# Altium schematic sheet SCHEMA.SchDoc
size 381 x 241 mm; SheetNumber: 1; SheetTotal: 1
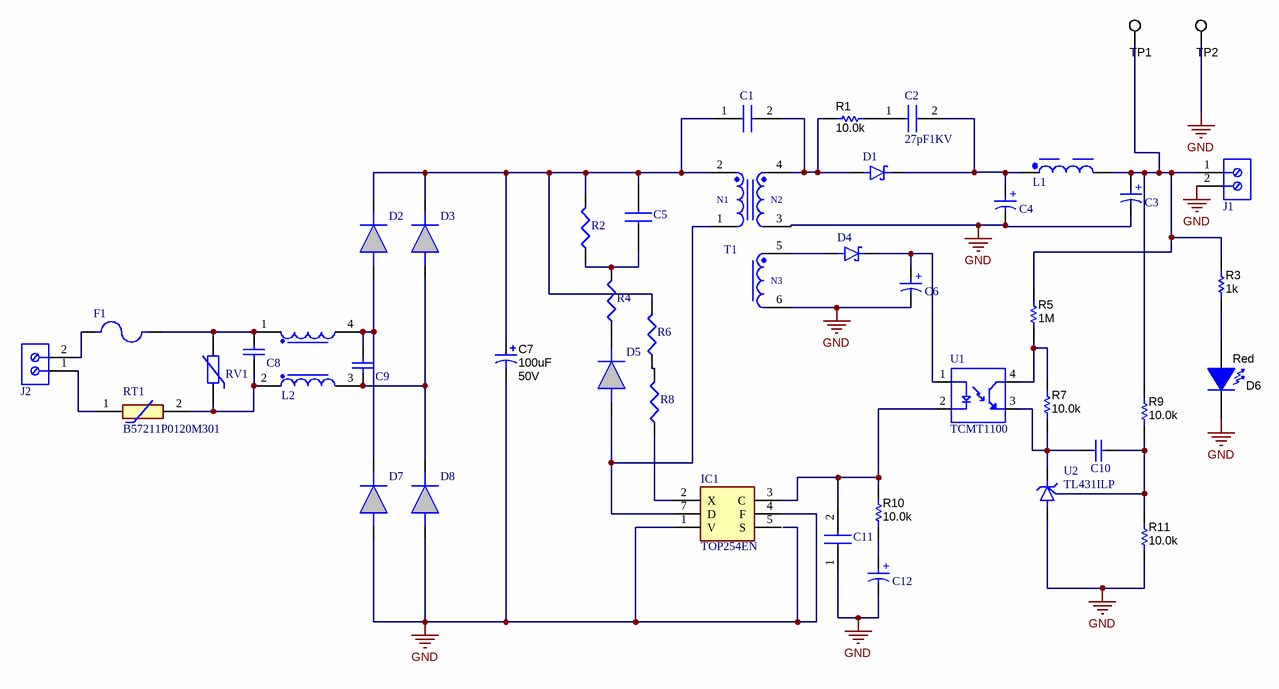
[diagram p0: SCHEMA.SchDoc]

## Parts
C1  c270.22nf-250VAC  [440LT22R]  (value not drawn)
C2  27pF1KV  [S270K25SL0N63L6R]
C3  180µF  [WCAP-PTG5_D8H8]  (value not drawn)
C4  22uF  [WCAP-ATG8_D5H11]  (value not drawn)
C5  FG26C0G2J391JNT06  [capacitor_ceramic]  (value not drawn)
C6  22uF  [WCAP-ATG8_D5H11]  (value not drawn)
C7  ValueDisplayed: 100uF  VDC_V: 50V  [BT_1000x1250]  (hidden comment: UBT1H101MPD1TD)
C8  15nF  [WCAP-FTX2_L11W6H10]  (value not drawn)
C9  15nF  [WCAP-FTX2_L11W6H10]  (value not drawn)
C10  15nF  [WCAP-FTX2_L11W6H10]  (value not drawn)
C11  0.1 μF, 50 V, Ceramic, X7R  [C322]  (value not drawn)
C12  180µF  [WCAP-PTG5_D8H8]  (value not drawn)
D1  diode shotcky  [DIOM7959X265N]  (value not drawn)
D2  1N4006-E3_54  [DIOAD1405W86L465D235]  (value not drawn)
D3  1N4006-E3_54  [DIOAD1405W86L465D235]  (value not drawn)
D4  diode shotcky  [DIOM7959X265N]  (value not drawn)
D5  RMPG06K-E3_54  [DIOAD1271W66L305D242]  (value not drawn)
D6  value Red  [LED_LTST-C190_Red]  (hidden comment: LTST-C190CKT)
D7  1N4006-E3_54  [DIOAD1405W86L465D235]  (value not drawn)
D8  1N4006-E3_54  [DIOAD1405W86L465D235]  (value not drawn)
F1  fuse tht  [FUSE_0154004.DR]  (value not drawn)
IC1  TOP254EN  [TOP265EG]
J1  691101710002  [691103110002]  (value not drawn)
J2  691101710002  [Model Name]  (value not drawn)
L1  3900µH, 0.18A  [INDUCTOR_TH]  (value not drawn)
L2  39mH  [WE-CMB_Type L_L27.5W18.5H33]  (value not drawn)
R1  ValueDisplayed: 10.0k  [RES_0603]  (hidden comment: ERA-3ARW103V)
R2  0.15Ω  [RESAD1590W60L630D240]  (value not drawn)
R3  value 1k  [0402L]  (hidden comment: CRCW0402510RJNED)
R4  0.15Ω  [RESAD1590W60L630D240]  (value not drawn)
R5  ValueDisplayed: 1M  [0603L]  (hidden comment: ERA-3ARW103V)
R6  0.15Ω  [RESAD1590W60L630D240]  (value not drawn)
R7  ValueDisplayed: 10.0k  [RES_0603]  (hidden comment: ERA-3ARW103V)
R8  0.15Ω  [RESAD1590W60L630D240]  (value not drawn)
R9  ValueDisplayed: 10.0k  [RES_0603]  (hidden comment: ERA-3ARW103V)
R10  ValueDisplayed: 10.0k  [RES_0603]  (hidden comment: ERA-3ARW103V)
R11  ValueDisplayed: 10.0k  [RES_0603]  (hidden comment: ERA-3ARW103V)
RT1  B57211P0120M301  [B57211P0***M3*1]
RV1  130VAC, 170VDC  [VARISTOR]  (value not drawn)
T1  85-265Vin, 5Vout  [TRANSFORMER_E22]  (value not drawn)
TP1  5016  [Testpoint_Keystone_Compact]  (value not drawn)
TP2  5016  [Testpoint_Keystone_Compact]  (value not drawn)
U1  TCMT1100  [SOIC127P700X230-4N]
U2  TL431ILP  [TL431CLP]

## Nets
GND: C3.2(N) C4.2(N) C6.2(N) C7.2(-) C11.1 C12.2(N) D6.2(K) D7.2(A) D8.2(A) IC1.1(V) IC1.4(F) J1.2 R11.1 T1.3 T1.6 TP2.1 U2.2(A)
NetC1_1: C1.1 C5.1 C7.1(+) D2.1(K) D3.1(K) R2.2 R6.2 T1.2
NetC1_2: C1.2 D1.A R1.2 T1.4
NetC2_1: C2.1 R1.1
NetC2_2: C2.2 C4.1(P) D1.C(K) L1.1
NetC3_1: C3.1(P) J1.1 L1.2 R3.2 R5.1 R9.2 TP1.1
NetC5_2: C5.2 R2.1 R4.2
NetC6_1: C6.1(P) D4.C(K) U1.1(A)
NetC8_1: C8.1 L2.2 RT1.2 RV1.1
NetC8_2: C8.2 F1.2 L2.1 RV1.2
NetC9_1: C9.1 D3.2(A) D8.1(K) L2.3
NetC9_2: C9.2 D2.2(A) D7.1(K) L2.4
NetC10_1: C10.1 R7.2 U1.3(ET) U2.3(C)
NetC10_2: C10.2 R9.1 R11.2 U2.1(REF)
NetC11_2: C11.2 IC1.3(C) R10.1 U1.2(C)
NetC12_1: C12.1(P) R10.2
NetD4_A: D4.A T1.5
NetD5_1: D5.1(K) R4.1
NetD5_2: D5.2(A) IC1.7(D) T1.1
NetD6_1: D6.1(A) R3.1
NetF1_1: F1.1 J2.2
NetIC1_2: IC1.2(X) R8.1
NetJ2_1: J2.1 RT1.1
NetR5_2: R5.2 R7.1 U1.4(CT)
NetR6_1: R6.1 R8.2

Not connected (* = marked no-connect by the designer): IC1 5(S)

## Notes on the sheet
- (in symbol 100uf 16v) +
- (in symbol 1800uf 25v) +
- (in symbol 749118105) N1; N2; N3

## Library data of the parts
C1 = c270.22nf-250VAC: Capacitor; Manufacturer_Name: Vishay; Manufacturer_Part_Number: 440LT22-R; Datasheet Link: https://componentsearchengine.com/Datasheets/2/440LT22-R.pdf; Height: 11.6mm; Mouser Part Number: 75-440LT22-R; Mouser Price/Stock: https://www.mouser.co.uk/ProductDetail/Vishay/440LT22-R?qs=SlHcmTmoTud7%252BtFxR7La5w%3D%3D; Arrow Part Number: 440LT22-R; Arrow Price/Stock: https://www.arrow.com/en/products/440lt22-r/vishay
C2 = 27pF1KV: Capacitor; Manufacturer_Name: Vishay; Datasheet Link: https://www.vishay.com/docs/28515/sseries.pdf; Height: 9.5mm; Manufacturer_Part_Number: S270K25SL0N63L6R; Mouser Part Number: 594-S270K25SL0N63L6R; Mouser Price/Stock: https://www.mouser.co.uk/ProductDetail/Vishay-BC-Components/S270K25SL0N63L6R?qs=a%252BZougrH3ejvblLoEtzSMA%3D%3D; Arrow Part Number: S270K25SL0N63L6R; Arrow Price/Stock: https://www.arrow.com/en/products/s270k25sl0n63l6r/vishay
C3 C12 = 100uf 16v: WCAP-PTG5 Aluminum Polymer Capacitor, Radial THT, D8 x H8mm, 180µF, 6.3V; Manufacturer Part Number: 870025174001; Manufacturer: Wurth Elektronik; Capacitance Tolerance: +/-20%; Dissipation Factor: 7%; Endurance: 2000h; ESR: 21mΩ; Leakage Current: 226.8µA; Ripple Current: 5100mA; Technical Reference: PTEE080181M6R3DSPA7B000; Category: Aluminum Polymer Capacitors; Match Code: WCAP-PTG5; ComponentLink1Description: Website Link; ComponentLink1URL: https://www.we-online.com/redexpert/article/870025174001?ad; ComponentLink2Description: Datasheet Link; ComponentLink2URL: https://www.we-online.com/redexpert/spec/870025174001?ad; Mount: Through Hole; Operating Temperature Max: 105°C; Operating Temperature Min: -55°C; Packaging: Ammo Pack; Height: 8mm; Diameter: 8mm; Capacitance: 180µF; Rated Voltage (DC): 6.3V
C4 C6 = 1800uf 25v: WCAP-ATG8 Aluminum Electrolytic Capacitor, Radial, THT, D5 x H11mm, 22uF, 10V; Manufacturer Part Number: 860010272001; Manufacturer: Wurth Elektronik; Capacitance Tolerance: +/-20%; Dissipation Factor: 19%; Endurance: 2000h; Leakage Current: 3uA; Ripple Current: 66mA; Technical Reference: ATBC110220M010DSPA3B000; Category: Aluminum Electrolytic Capacitors; Match Code: WCAP-ATG8; ComponentLink1Description: Website Link; ComponentLink1URL: https://www.we-online.com/redexpert/article/860010272001?ad; ComponentLink2Description: Datasheet Link; ComponentLink2URL: https://www.we-online.com/redexpert/spec/860010272001?ad; Mount: Through Hole; Operating Temperature Max: 85°C; Operating Temperature Min: -40°C; Packaging: Ammo Pack; Height: 11mm; Diameter: 5mm; Capacitance: 22uF; Rated Voltage (DC): 10V
C5 = 1.5 nF, 630 V, High Voltage Ceramic: MLCC with Dipped Radial Lead, Capacitance=390pF, LxWxT:5.5x6x3.5mm, Lead pitch:5mm; Manufacturer_Name: TDK; Geometry.Height: 6mm; Mouser Part Number: 810-FG26C0G2J391JNT6; Mouser Price/Stock: https://www.mouser.co.uk/ProductDetail/TDK/FG26C0G2J391JNT06?qs=icAhCOE9TbgfNHYPSEYhhw%3D%3D; Manufacturer_Part_Number: FG26C0G2J391JNT06; Datasheet Link: https://product.tdk.com/system/files/dam/doc/product/capacitor/ceramic/lead-mlcc/catalog/leadmlcc_halogenfree_fg_en.pdf
C7 = CMP-0009918-2: CAP, AL, 100 uF, 50 V, +/- 20%, TH; Manufacturer: Nichicon; Polarized: Y; CompType: Capacitor; Value: 100uF; U/M: EA; Cap_F: 100µF; Value1: Unknown; IRMS_A: 5.55dA; TaMin_C: -40°C; TaMax_C: 125°C; Cap_Case: 10x12.5mm; SizeAreaWB_mm2: 144; SizeArea_mm2: 100; SizeX_mm: 10; SizeZ_mm: 14.5; AEC Category: Q200; AEC Qualified: N; PartNumber: UBT1H101MPD1TD; PackageReference: Cap, 10x12.5mm; RoHS: Y; Tolerance_%: 20%; Value2: 50V; MountType: TH; Technology: AL; Series: BT; Publisher: Texas Instruments; LatestRevisionDate: 2017-03-09; ComponentLink1Description: Datasheet link; ComponentLink1URL: http://nichicon-us.com/english/products/pdfs/e-ubt.pdf; Supplier 1: Digi-Key; Supplier Part Number 1: 493-4508-1-ND; Supplier 2: Newark; Supplier Part Number 2: 26T5990; Supplier 3: Mouser; Supplier Part Number 3: 647-UBT1H101MPD1TD; SizeY_mm: 10; AEC Grade: N/A
C8-C10 = 100nF275V iNPUT choke: WCAP-FTX2 Film Capacitor, THT, L11 x W6 x H10mm, 15nF, 275V; Manufacturer Part Number: 890324022007; Manufacturer: Wurth Elektronik; Capacitance Tolerance: +/-10%; Dissipation Factor @1kHz: 0.1%; Dissipation Factor @100kHz: 0.5%; Insulation Resistance: 30000MΩ; Pitch: 7.5mm; Rate of Voltage Rise: 500V/µs; Technical Reference: MX2P075153K275ASPB15000; Category: Film Capacitors; Match Code: WCAP-FTX2; ComponentLink1Description: Website Link; ComponentLink1URL: https://www.we-online.com/redexpert/article/890324022007?ad; ComponentLink2Description: Datasheet Link; ComponentLink2URL: https://www.we-online.com/redexpert/spec/890324022007?ad; Mount: Through Hole; Operating Temperature Max: 105°C; Operating Temperature Min: -40°C; Packaging: Carton; Length: 11mm; Width: 6mm; Height: 10mm; Capacitance: 15nF; Dissipation Factor @10kHz: 0.1%; Rated Voltage (AC): 275V
C11 = 0.1 μF, 50 V, Ceramic, X7R: Capacitor; Manufacturer_Name: KEMET; Manufacturer_Part_Number: C322C104K5R5TA; Datasheet Link: https://content.kemet.com/datasheets/KEM_C1050_GOLDMAX_X7R.pdf; Height: 6.6mm; Mouser Part Number: 80-C322C104K5R; Mouser Price/Stock: https://www.mouser.co.uk/ProductDetail/KEMET/C322C104K5R5TA?qs=XvIqZs20p47gvrtGJkxvnw%3D%3D; Arrow Part Number: C322C104K5R5TA; Arrow Price/Stock: https://www.arrow.com/en/products/c322c104k5r5ta/kemet-corporation?region=nac
D1 D4 = diode shotcky: Diode Schottky 40 V 3A Surface Mount SMC (DO-214AB); MF: ON Semiconductor; MP: SS34; Package: SMC-2 ON Semiconductor; Value: *; Availability: In Stock; SnapEDA_Link: https://www.snapeda.com/parts/SS34/Onsemi/view-part/?ref=snap; Price: None; Check_prices: https://www.snapeda.com/parts/SS34/Onsemi/view-part/?ref=eda
D2 D3 D7 D8 = 1N4006-E3_54_1: Vishay 1N4006-E3/54 Diode, 800V 1A, 2-Pin DO-204AL; Mouser Part Number: 625-1N4006-E3/54; Mouser Price/Stock: https://www.mouser.co.uk/ProductDetail/Vishay-General-Semiconductor/1N4006-E3-54?qs=N4vtoAxH%2FSrsleYv417wqA%3D%3D; Manufacturer_Name: Vishay; Manufacturer_Part_Number: 1N4006-E3/54; Datasheet Link: https://componentsearchengine.com/Datasheets/2/1N4006-E3_54.pdf
D5 = RMPG06K-E3_54: Rectifiers 800 Volt 1.0A 250ns 40 Amp IFSM; Manufacturer_Name: Vishay; Manufacturer_Part_Number: RMPG06K-E3/54; Mouser Part Number: 625-RMPG06K-E3; Mouser Price/Stock: https://www.mouser.co.uk/ProductDetail/Vishay-General-Semiconductor/RMPG06K-E3-54?qs=lBalI7KQBwrCsBsrBsMpUw%3D%3D; Datasheet Link: https://componentsearchengine.com/Datasheets/1/RMPG06K-E3_54.pdf
D6 = LTST-C190CKT: LED, Red, SMD; Manufacturer: Lite-On; Vf_V: 2; Value2: 2V; Io_A: 0.02; Tjmax_C: 85; Power_TotalModule: 0.0625; Value1: 0.0625W; U/M: EA; ComponentLink1URL: http://optoelectronics.liteon.com/en-us/api/DwonloadFileHandler.ashx?txtSpecNo=DS-22-98-0009&txtPartNo=LTST-C190CKT; SymbolVersion: 2008-12-08; PackageReference: Red LED, 1.6x0.8x0.8mm; PartNumber: LTST-C190CKT; ComponentLink1Description: Datasheet link; Supplier 1: Digi-Key; Supplier Part Number 1: 160-1181-1-ND; MountType: SMT; CompType: LED; RoHS: Y; Type: ?; Color: red; Published: 2008-07-11; Publisher: Texas Instruments; LatestRevisionDate: 2015-06-04; Supplier 2: Mouser; Supplier Part Number 2: 859-LTST-C190CKT
F1 = fuse tht: 2-Pin Radial Fuse | Rectangular | Slow Blow | UL | Bulk Pack | 250mA; MP: 0697H9200-02; Package: None; Price: None; Value: *; Availability: Unavailable
IC1 = TOP254EN: Integrated Circuit; Manufacturer_Name: Power Integrations; Datasheet Link: https://datasheet.datasheetarchive.com/originals/dk/DKDS-24/462824.pdf; Height: 8.25mm; Manufacturer_Part_Number: TOP254EN; Mouser Part Number: 869-TOP254EN; Mouser Price/Stock: https://www.mouser.co.uk/ProductDetail/Power-Integrations/TOP254EN?qs=Xb8IjHhkxj4nAN0FapBmAQ%3D%3D
J1 J2 = 691101710002: WR-TBL Series 101 Horizontal Entry Modular, THT, pitch 5mm, 2p; Manufacturer: Wurth Elektronik; Modularity: Yes; Rated Current: 16A; Working Voltage: 250V; ComponentLink1Description: Website Link; ComponentLink1URL: https://www.we-online.com/redexpert/article/691101710002?ad; ComponentLink2Description: Datasheet Link; ComponentLink2URL: https://www.we-online.com/redexpert/spec/691101710002?ad; Manufacturer Part Number: 691101710002; Category: Terminal Blocks; Match Code: WR-TBL; Mount: Through Hole; Operating Temperature Max: 105°C; Operating Temperature Min: -40°C; Packaging: Box; Application: Pressure Clamp; Number of Pins: 2; Number of Rows: 1; Orientation: Horizontal; Pitch: 5mm
L1 = 744730392: WE-TI Radial Leaded Wire Wound Inductor, size 8075, 3900µH, 0.18A, 12Ω; Manufacturer: Wurth Elektronik; Case/Size Code: 8075; DC Resistance: 9.5Ω; Saturation Current: 0.2A; Self Resonant Frequency: 1.04MHz; Manufacturer Part Number: 744730392; Category: Unshielded Power Inductors; Match Code: WE-TI; ComponentLink1Description: Website Link; ComponentLink1URL: https://www.we-online.com/redexpert/article/744730392?ad; ComponentLink2Description: Datasheet Link; ComponentLink2URL: https://www.we-online.com/redexpert/spec/744730392?ad; Mount: Through Hole; Operating Temperature Max: 125°C; Operating Temperature Min: -40°C; Packaging: Tray; Height: 8mm; Diameter: 9.5mm; DC Resistance Max: 12Ω; Inductance: 3900µH; Rated Current: 0.18A
L2 = 744821039: WE-CMB Common Mode Power Line Choke, THT, Type XS, 39mH, 0.3A, 3000mOhm; Manufacturer: Wurth Elektronik; Case/Size Code: Type XS; Insulation Test Voltage: 1500VAC; Material: MnZn; Rated Voltage (AC): 250V; Manufacturer Part Number: 744821039; Category: Common Mode Chokes; Match Code: WE-CMB; ComponentLink1Description: Website Link; ComponentLink1URL: https://www.we-online.com/redexpert/article/744821039?ad; ComponentLink2Description: Datasheet Link; ComponentLink2URL: https://www.we-online.com/redexpert/spec/744821039?ad; Mount: Through Hole; Operating Temperature Max: 125°C; Operating Temperature Min: -40°C; Packaging: Carton; Length: 15mm; Width: 7.5mm; Height: 18mm; DC Resistance Max: 3000mOhm; Inductance: 39mH; Rated Current: 0.3A
R1 R7 R9-R11 = REStht: RES, 10.0 k, 0.05%, 0.1 W, AEC-Q200 Grade 0, 0603; Manufacturer: Panasonic; Res_ohm: 10k; CompType: Resistor; Value: 10.0k; SizeY_mm: 0.8; SizeArea_mm2: 1.28; SizeAreaWB_mm2: 4.68; AEC Grade: 0; Power_W: 100mW; SizeX_mm: 1.6; Value2: 0.1W; Value_Code: 10k0; SizeZ_mm: 1; AEC Qualified: Y; AEC Category: Q200; TempCo: 10 ppm/C; ComponentLink1URL: https://industrial.panasonic.com/cdbs/www-data/pdf/RDM0000/AOA0000C307.pdf; Value1: 0.05%; RoHS: Y; MountType: SMT; PartNumber: ERA-3ARW103V; PackageReference: 0603; ComponentLink1Description: Datasheet link; Tolerance_%: 0.05%; Technology: Thin Film
R2 R4 R6 R8 = RES-THT: WRIS-KSKE Thick Film Resistor, SMT, size 0402, 0.125W, 0.15Ω, +/-1%; Manufacturer Part Number: 560050310002; Manufacturer: Wurth Elektronik; Case/Size Code: 0402; Rated Current: 0.91A; Technical Reference: KE0402R150F108IAATH0000; Temperature Coefficient of Resistance: 300ppm/°C; Category: Thick Film Resistors; Match Code: WRIS-KSKE; ComponentLink1Description: Website Link; ComponentLink1URL: https://www.we-online.com/redexpert/article/560050310002?ad; ComponentLink2Description: Datasheet Link; ComponentLink2URL: https://www.we-online.com/redexpert/spec/560050310002?ad; Mount: Surface Mount; Operating Temperature Max: 155°C; Operating Temperature Min: -55°C; Packaging: Tape and Reel; Length: 1mm; Width: 0.5mm; Height: 0.35mm; Rated Power: 0.125W; Resistance: 0.15Ω; Resistance Tolerance: +/-1%
R3 = CRCW0402510RJNED: RES, 510, 5%, 0.063 W, 0402; Manufacturer: Vishay-Dale; CompType: Resistor; Res_ohm: 510; Value_Code: 510R; Tolerance_%: 5; Power_W: 0.063; Value2: 0.063W; VDC_V: 50; TempCo: 200 ppm/C; EIA_Code: E24; U/M: EA; SymbolVersion: 2009-05-29; PartNumber: CRCW0402510RJNED; PackageReference: 0402; RoHS: Y; Value1: 5%; MountType: SMT; Technology: Thick Film; Published: 2008-06-26; Publisher: Texas Instruments; LatestRevisionDate: 2015-05-27; ComponentLink1Description: Datasheet link; ComponentLink1URL: http://www.vishay.com/docs/20035/dcrcwe3.pdf; Supplier 1: Digi-Key; Supplier Part Number 1: 541-510JCT-ND; Supplier 2: Mouser; Supplier Part Number 2: 71-CRCW0402J-510-E3; Supplier 3: Farnell; Supplier Part Number 3: 1570682; ValueDisplayed: 510
R5 = RES-10K-0603: RES, 10.0 k, 0.05%, 0.1 W, AEC-Q200 Grade 0, 0603; Manufacturer: Panasonic; Res_ohm: 10k; CompType: Resistor; Value: 10.0k; SizeY_mm: 0.8; SizeArea_mm2: 1.28; SizeAreaWB_mm2: 4.68; AEC Grade: 0; Power_W: 100mW; SizeX_mm: 1.6; Value2: 0.1W; Value_Code: 10k0; SizeZ_mm: 1; AEC Qualified: Y; AEC Category: Q200; TempCo: 10 ppm/C; ComponentLink1URL: https://industrial.panasonic.com/cdbs/www-data/pdf/RDM0000/AOA0000C307.pdf; Value1: 0.05%; RoHS: Y; MountType: SMT; PartNumber: ERA-3ARW103V; PackageReference: 0603; ComponentLink1Description: Datasheet link; Tolerance_%: 0.05%; Technology: Thin Film
RT1 = B57211P0120M301: Thermistor; Manufacturer_Name: TDK; Datasheet Link: https://product.tdk.com/system/files/dam/doc/product/protection/current/ntc-limiter/data_sheet/50/db/icl_16/p11.pdf; Height: 13mm; Manufacturer_Part_Number: B57211P0120M301; Mouser Part Number: 871-B57211P0120M301; Mouser Price/Stock: https://www.mouser.co.uk/ProductDetail/EPCOS-TDK/B57211P0120M301?qs=t%252BrwbUv0m%252Bw8A0wWx07HMQ%3D%3D; Arrow Part Number: B57211P0120M301; Arrow Price/Stock: https://www.arrow.com/en/products/b57211p0120m301/epcos-tdk
RV1 = 820411311: WE-VD Disk Varistor, THT, 130VAC, 170VDC, 410pF; Manufacturer: Wurth Elektronik; Clamping Voltage: 340V; Energy Absorption: 35J; Operating Voltage (AC): 130V; Operating Voltage (DC): 170V; Pitch: 0.8mm; Power Dissipation: 0.4W; (Reverse) Breakdown Voltage: 200V; (Reverse) Peak Pulse Current: 3500A; Manufacturer Part Number: 820411311; Category: Surge Protection; Match Code: WE-VD; ComponentLink1Description: Website Link; ComponentLink1URL: https://www.we-online.com/redexpert/article/820411311?ad; ComponentLink2Description: Datasheet Link; ComponentLink2URL: https://www.we-online.com/redexpert/spec/820411311?ad; Mount: Through Hole; Operating Temperature Max: 85°C; Operating Temperature Min: -40°C; Packaging: Tape and Reel; Width: 4.6mm; Height: 15.5mm; Diameter: 12.5mm; Channel Input Capacitance: 410pF
T1 = 749118105: WE-UNIT Off-Line Transformer, THT, E13/7/4_Vertical, 85-265Vin, 5Vout, 3W; Manufacturer: Wurth Elektronik; Inductance: 2.8mH; Input Voltage: 85-265VAC; Insulation Test Voltage: 4000VAC; Leakage Inductance: 280uH; Output Current: 0.6A; Output Voltage: 5V; Saturation Current: 0.2A; Switching Frequency: 132kHz; Turns Ratio: 18.9:1; Manufacturer Part Number: 749118105; Category: Transformers For AC-DC Converter; Match Code: WE-UNIT; ComponentLink1Description: Website Link; ComponentLink1URL: https://www.we-online.com/redexpert/article/749118105?ad; ComponentLink2Description: Datasheet Link; ComponentLink2URL: https://www.we-online.com/redexpert/spec/749118105?ad; Mount: Through Hole; Operating Temperature Max: 125°C; Operating Temperature Min: -40°C; Packaging: Tray; Case/Size Code: E13/7/4_Vertical; Length: 15mm; Width: 11mm; Height: 16.8mm; Output Power: 3W
TP1 TP2 = 5016: Test Point, Compact, SMT; Manufacturer: Keystone; CompType: Test Point Loop; U/M: EA; SymbolVersion: 2008-04-04; PartNumber: 5016; Value: SMT; RoHS: Y; PackageReference: Testpoint_Keystone_Compact; MountType: SMT; ComponentLink1Description: Datasheet Link; ComponentLink1URL: http://www.keyelco.com/userAssets/store/files/5016.PDF; Publisher: Texas Instruments; LatestRevisionDate: 2015-05-13; Supplier 1: Digi-Key; Supplier Part Number 1: 5016KCT-ND
U1 = TCMT1100: Optoisolator Transistor Output 3750Vrms 1 Channel 4-SOP; MF: Vishay Semiconductor; Digi-Key_Part_Number: TCMT1100CT-ND; Mouser-Purchase-URL: https://snapeda.com/shop?store=Mouser&id=286066; MP: TCMT1100; DigiKey-Purchase-URL: https://snapeda.com/shop?store=DigiKey&id=286066; Package: SOP-4 Vishay; SnapEDA_Link: https://www.snapeda.com/parts/TCMT1100/Vishay%20Semiconductor%20Opto%20Division/view-part/286066/?ref=snap; Value: *; Check_prices: https://www.snapeda.com/parts/TCMT1100/Vishay%20Semiconductor%20Opto%20Division/view-part/286066/?ref=eda
U2 = TL431ILP: Ic, Tl431ilp, Tl431, Tl431a, Tl4 31b, Tl432, Tl432a, Tl432b<Nv; Package: None; MP: TL431ILP; Price: None; Availability: Unavailable; Value: *